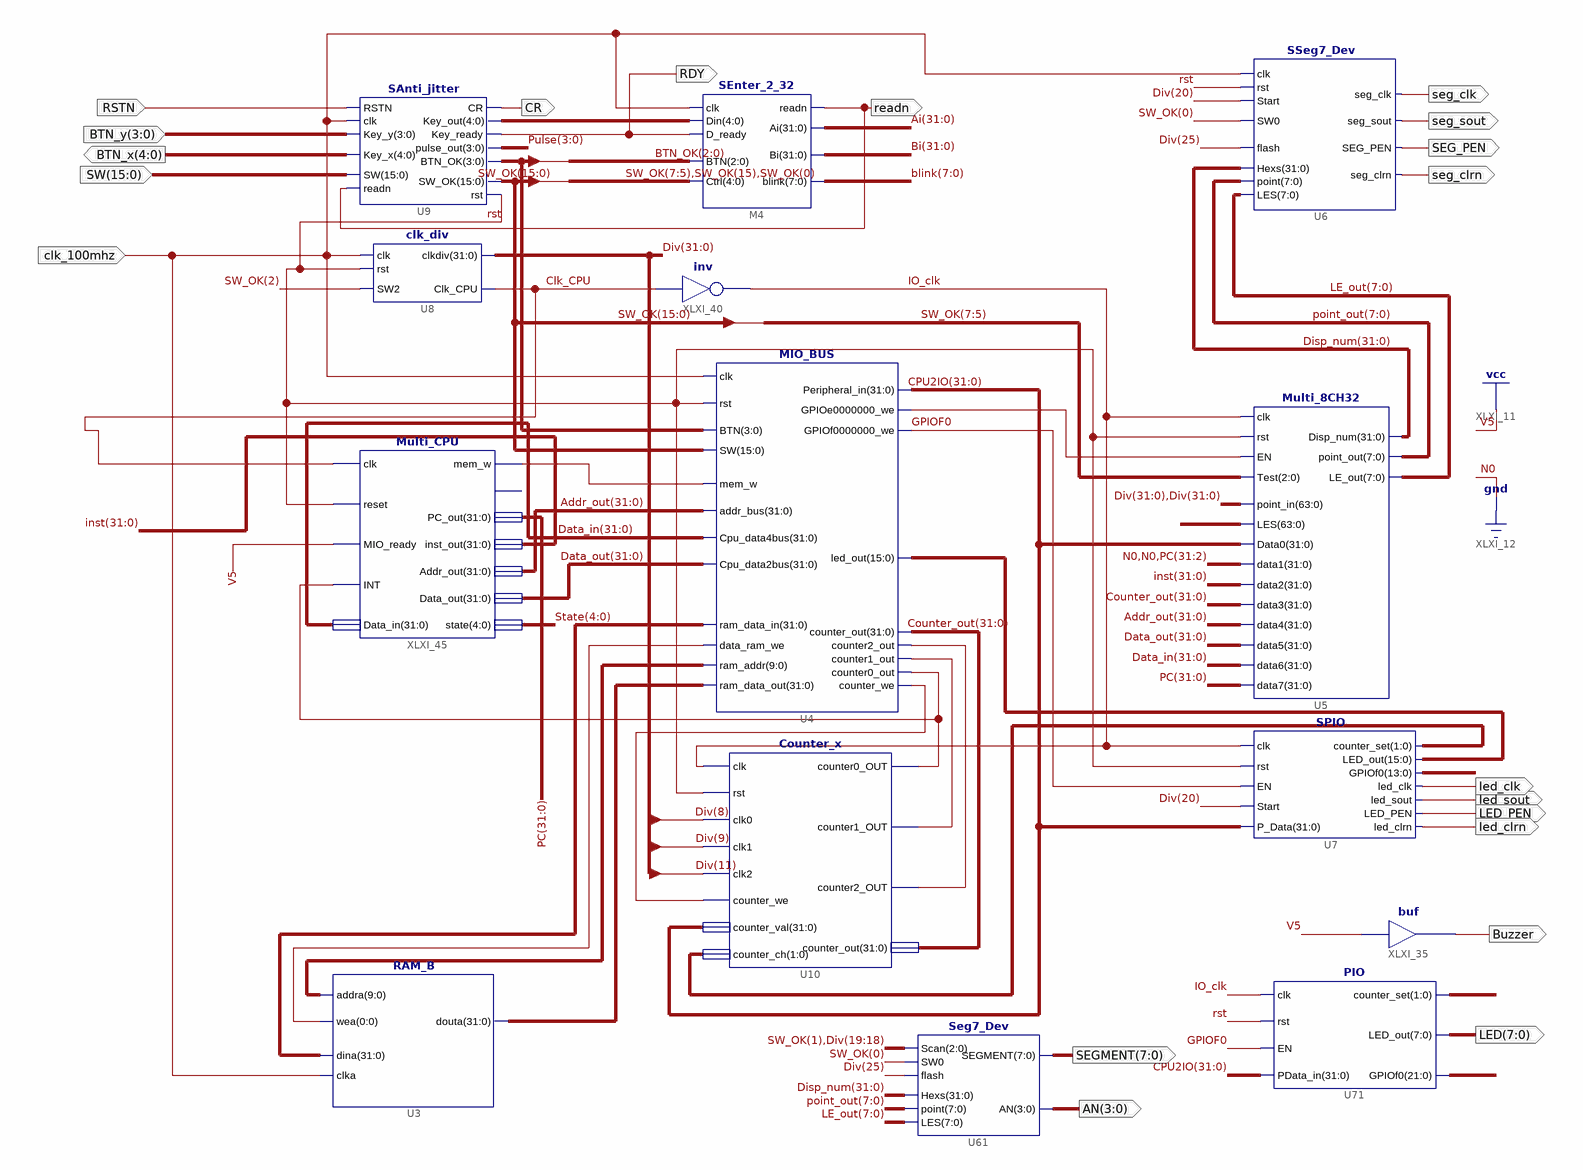
[diagram p0: schematic sheet 1]
// Xilinx ISE schematic OExp09_MCPU.sch (kintex7) as structural Verilog: 14 symbols, 20 ports
module OExp09_MCPU (
  input  RSTN,
  input  [3:0] BTN_y,
  input  [15:0] SW,
  input  clk_100mhz,
  output [4:0] BTN_x,
  output CR,
  output RDY,
  output readn,
  output [7:0] LED,
  output Buzzer,
  output [7:0] SEGMENT,
  output [3:0] AN,
  output led_clrn,
  output LED_PEN,
  output led_sout,
  output led_clk,
  output seg_clk,
  output seg_sout,
  output SEG_PEN,
  output seg_clrn
);

  wire Clk_CPU, GPIOe0000000_we, GPIOF0, IO_clk, rst, XLXN_325, XLXN_400, XLXN_401, XLXN_428, XLXN_429;
  wire [0:0] data_ram_we;
  wire [1:0] counter_set, XLXN_432;
  wire [3:0] BTN_OK, Pulse;
  wire [4:0] State, XLXN_13;
  wire [7:0] blink, LE_out, point_out;
  wire [9:0] ram_addr;
  wire [13:0] XLXN_73;
  wire [15:0] LED_out, SW_OK;
  wire [21:0] GPIOf0_PIO;
  wire [31:0] Addr_out, Ai, Bi, Counter_out, CPU2IO, Data_in, Data_out, Disp_num, Div, inst, PC, ram_data_in,
       ram_data_out;

  clk_div U8 (.rst(rst), .clk(clk_100mhz), .SW2(SW_OK[2]), .clkdiv(Div), .Clk_CPU(Clk_CPU));
  RAM_B U3 (.addra(ram_addr), .clka(clk_100mhz), .wea(data_ram_we[0]), .dina(ram_data_in), .douta(ram_data_out));
  SAnti_jitter U9 (
    .SW(SW), .readn(readn), .Key_y(BTN_y), .Key_x(BTN_x), .RSTN(RSTN), .clk(clk_100mhz), .Key_out(XLXN_13),
    .Key_ready(RDY), .CR(CR), .rst(rst), .SW_OK(SW_OK), .pulse_out(Pulse), .BTN_OK(BTN_OK));
  SEnter_2_32 M4 (
    .readn(readn), .Ai(Ai), .Bi(Bi), .blink(blink), .Din(XLXN_13), .D_ready(RDY), .clk(clk_100mhz),
    .Ctrl({SW_OK[7:5], SW_OK[15], SW_OK[0]}), .BTN(BTN_OK[2:0]));
  Multi_8CH32 U5 (
    .Test(SW_OK[7:5]), .point_in({Div, Div}), .EN(GPIOe0000000_we), .clk(IO_clk), .rst(rst),
    .LES({64{1'b0}}), .Data0(CPU2IO), .data1({2'b00, PC[31:2]}), .data2(inst), .data3(Counter_out),
    .data4(Addr_out), .data5(Data_out), .data6(Data_in), .data7(PC), .point_out(point_out), .LE_out(LE_out),
    .Disp_num(Disp_num));
  PIO U71 (
    .clk(IO_clk), .rst(rst), .EN(GPIOF0), .PData_in(CPU2IO), .GPIOf0(GPIOf0_PIO), .LED_out(LED),
    .counter_set(counter_set));
  buf XLXI_35 (Buzzer, 1'b1);
  MIO_BUS U4 (
    .rst(rst), .clk(clk_100mhz), .mem_w(XLXN_325), .addr_bus(Addr_out), .Cpu_data4bus(Data_in),
    .Cpu_data2bus(Data_out), .ram_data_out(ram_data_out), .ram_addr(ram_addr), .data_ram_we(data_ram_we[0]),
    .ram_data_in(ram_data_in), .counter_out(Counter_out), .counter2_out(XLXN_429), .counter1_out(XLXN_428),
    .counter0_out(XLXN_400), .counter_we(XLXN_401), .BTN(BTN_OK), .SW(SW_OK), .led_out(LED_out),
    .Peripheral_in(CPU2IO), .GPIOe0000000_we(GPIOe0000000_we), .GPIOf0000000_we(GPIOF0));
  not XLXI_40 (IO_clk, Clk_CPU);
  Counter_x U10 (
    .clk(IO_clk), .rst(rst), .clk0(Div[8]), .clk1(Div[9]), .clk2(Div[11]), .counter_we(XLXN_401),
    .counter_val(CPU2IO), .counter_ch(XLXN_432), .counter0_OUT(XLXN_400), .counter1_OUT(XLXN_428),
    .counter2_OUT(XLXN_429), .counter_out(Counter_out));
  Seg7_Dev U61 (
    .LES(LE_out), .Scan({SW_OK[1], Div[19:18]}), .SEGMENT(SEGMENT), .AN(AN), .point(point_out),
    .flash(Div[25]), .SW0(SW_OK[0]), .Hexs(Disp_num));
  SPIO U7 (
    .clk(IO_clk), .P_Data(CPU2IO), .rst(rst), .EN(GPIOF0), .Start(Div[20]), .led_clk(led_clk),
    .GPIOf0(XLXN_73), .LED_out(LED_out), .counter_set(XLXN_432), .led_clrn(led_clrn), .LED_PEN(LED_PEN),
    .led_sout(led_sout));
  SSeg7_Dev U6 (
    .LES(LE_out), .SEG_PEN(SEG_PEN), .seg_sout(seg_sout), .seg_clrn(seg_clrn), .point(point_out),
    .Hexs(Disp_num), .SW0(SW_OK[0]), .flash(Div[25]), .seg_clk(seg_clk), .clk(clk_100mhz), .rst(rst),
    .Start(Div[20]));
  Multi_CPU XLXI_45 (
    .clk(Clk_CPU), .reset(rst), .MIO_ready(1'b1), .INT(XLXN_400), .Data_in(Data_in), .mem_w(XLXN_325),
    .PC_out(PC), .inst_out(inst), .Addr_out(Addr_out), .Data_out(Data_out), .state(State));  // open: CPU_MIO
endmodule
